# Altium schematic sheet MCISO-S02-V00-PSU5VA.SchDoc
size A4; SheetNumber: 10; SheetTotal: 14
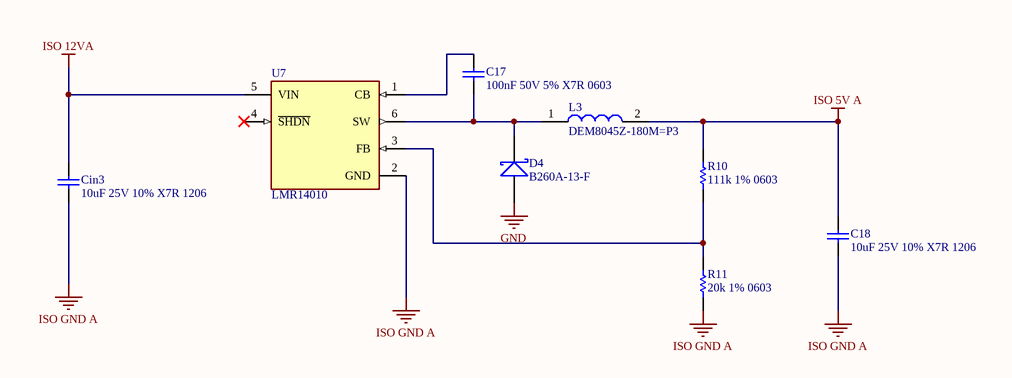
[diagram p0: MCISO-S02-V00-PSU5VA.SchDoc]

## Parts
C17  100nF 50V 5% X7R 0603  [Cap_Ceramic_0603]
C18  10uF 25V 10% X7R 1206  [Cap_Ceramic_1206]
Cin3  10uF 25V 10% X7R 1206  [Cap_Ceramic_1206]
D4  B260A-13-F  [SMA]
L3  DEM8045Z-180M=P3  [1217ASH100MP3]
R10  111k 1% 0603  [Res_ThinFilm_0603]
R11  20k 1% 0603  [Res_ThinFilm_0603]
U7  LMR14010  [LMR14010]

## Nets
GND: D4.A
ISO 5V A: C18.2 L3.2 R10.2
ISO 12VA: Cin3.2 U7.5(VIN)
ISO GND A: C18.1 Cin3.1 R11.1 U7.2(GND)
NetC17_1: C17.1 D4.K L3.1 U7.6(SW)
NetC17_2: C17.2 U7.1(CB)
NetR10_1: R10.1 R11.2 U7.3(FB)

Not connected (* = marked no-connect by the designer): U7 4(~{SHDN})*

## Library data of the parts
C17 = 100nF 50V 5% X7R 0603: Capacitor, Ceramic, SMD, 100nF, 50V, 5%, X7R, 0603
C18 Cin3 = 10uF 25V 10% X7R 1206: Capacitor, Ceramic, SMD, 10uF, 25V, 10%, X7R, 1206
D4 = B260A-13-F: Diode, Schottky Barrier Rectifier, 60 V, 2 A, B260A-13-F
L3 = DEM8045Z-180M=P3: Inductor; Manufacturer_Name: Murata Electronics; Datasheet Link: https://psearch.en.murata.com/inductor/product/DEM8045Z-180M%23.html; Height: 4.5mm; Manufacturer_Part_Number: DEM8045Z-180M=P3; Mouser Part Number: 81-DEM8045Z-180M=P3; Mouser Price/Stock: https://www.mouser.co.uk/ProductDetail/Murata-Electronics/DEM8045Z-180M%3dP3?qs=17u8i%2FzlE899jFmFr9F4%252Bg%3D%3D; Arrow Part Number: DEM8045Z-180M=P3; Arrow Price/Stock: https://www.arrow.com/en/products/dem8045z-180mp3/murata-manufacturing
R10 = 111k 1% 0603: Resistor, SMD, 111k, 0.1W, 1%, 0603
R11 = 20k 1% 0603: Resistor, SMD, 20k, 0.1W, 5%, 0603